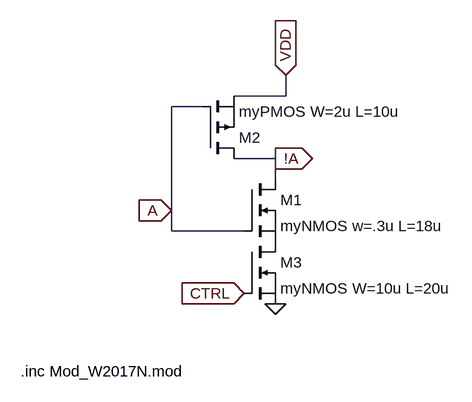
[diagram p0: schematic Gate_Starved_Inverter_fast.asc]
Gate_Starved_Inverter_fast.asc, the LTspice schematic file:
Version 4
SHEET 1 880 680
WIRE 64 -112 64 -144
WIRE 64 -112 -16 -112
WIRE -64 -96 -112 -96
WIRE 48 -16 -16 -16
WIRE 48 16 48 -16
WIRE -112 64 -112 -96
WIRE -112 96 -112 64
WIRE 0 96 -112 96
FLAG -112 64 A
IOPIN -112 64 In
FLAG 48 -16 !A
IOPIN 48 -16 Out
FLAG 64 -144 VDD
IOPIN 64 -144 In
FLAG 48 208 0
FLAG 0 192 CTRL
IOPIN 0 192 In
SYMBOL nmos 0 16 R0
SYMATTR InstName M1
SYMATTR Value myNMOS w=.3u L=18u
SYMBOL pmos -64 -16 M180
SYMATTR InstName M2
SYMATTR Value myPMOS W=2u L=10u
SYMBOL nmos 0 112 R0
SYMATTR InstName M3
SYMATTR Value myNMOS W=10u L=20u
TEXT -344 312 Left 2 !.inc Mod_W2017N.mod

The netlist it stands for:
* Gate_Starved_Inverter_fast.asc
M1 !A A P001 P001 myNMOS w=.3u L=18u
M2 !A A VDD VDD myPMOS W=2u L=10u
M3 P001 CTRL 0 0 myNMOS W=10u L=20u
.model NMOS NMOS
.model PMOS PMOS
.lib standard.mos
.inc Mod_W2017N.mod
.backanno
.end